# Altium project MT6205B.PrjPcb
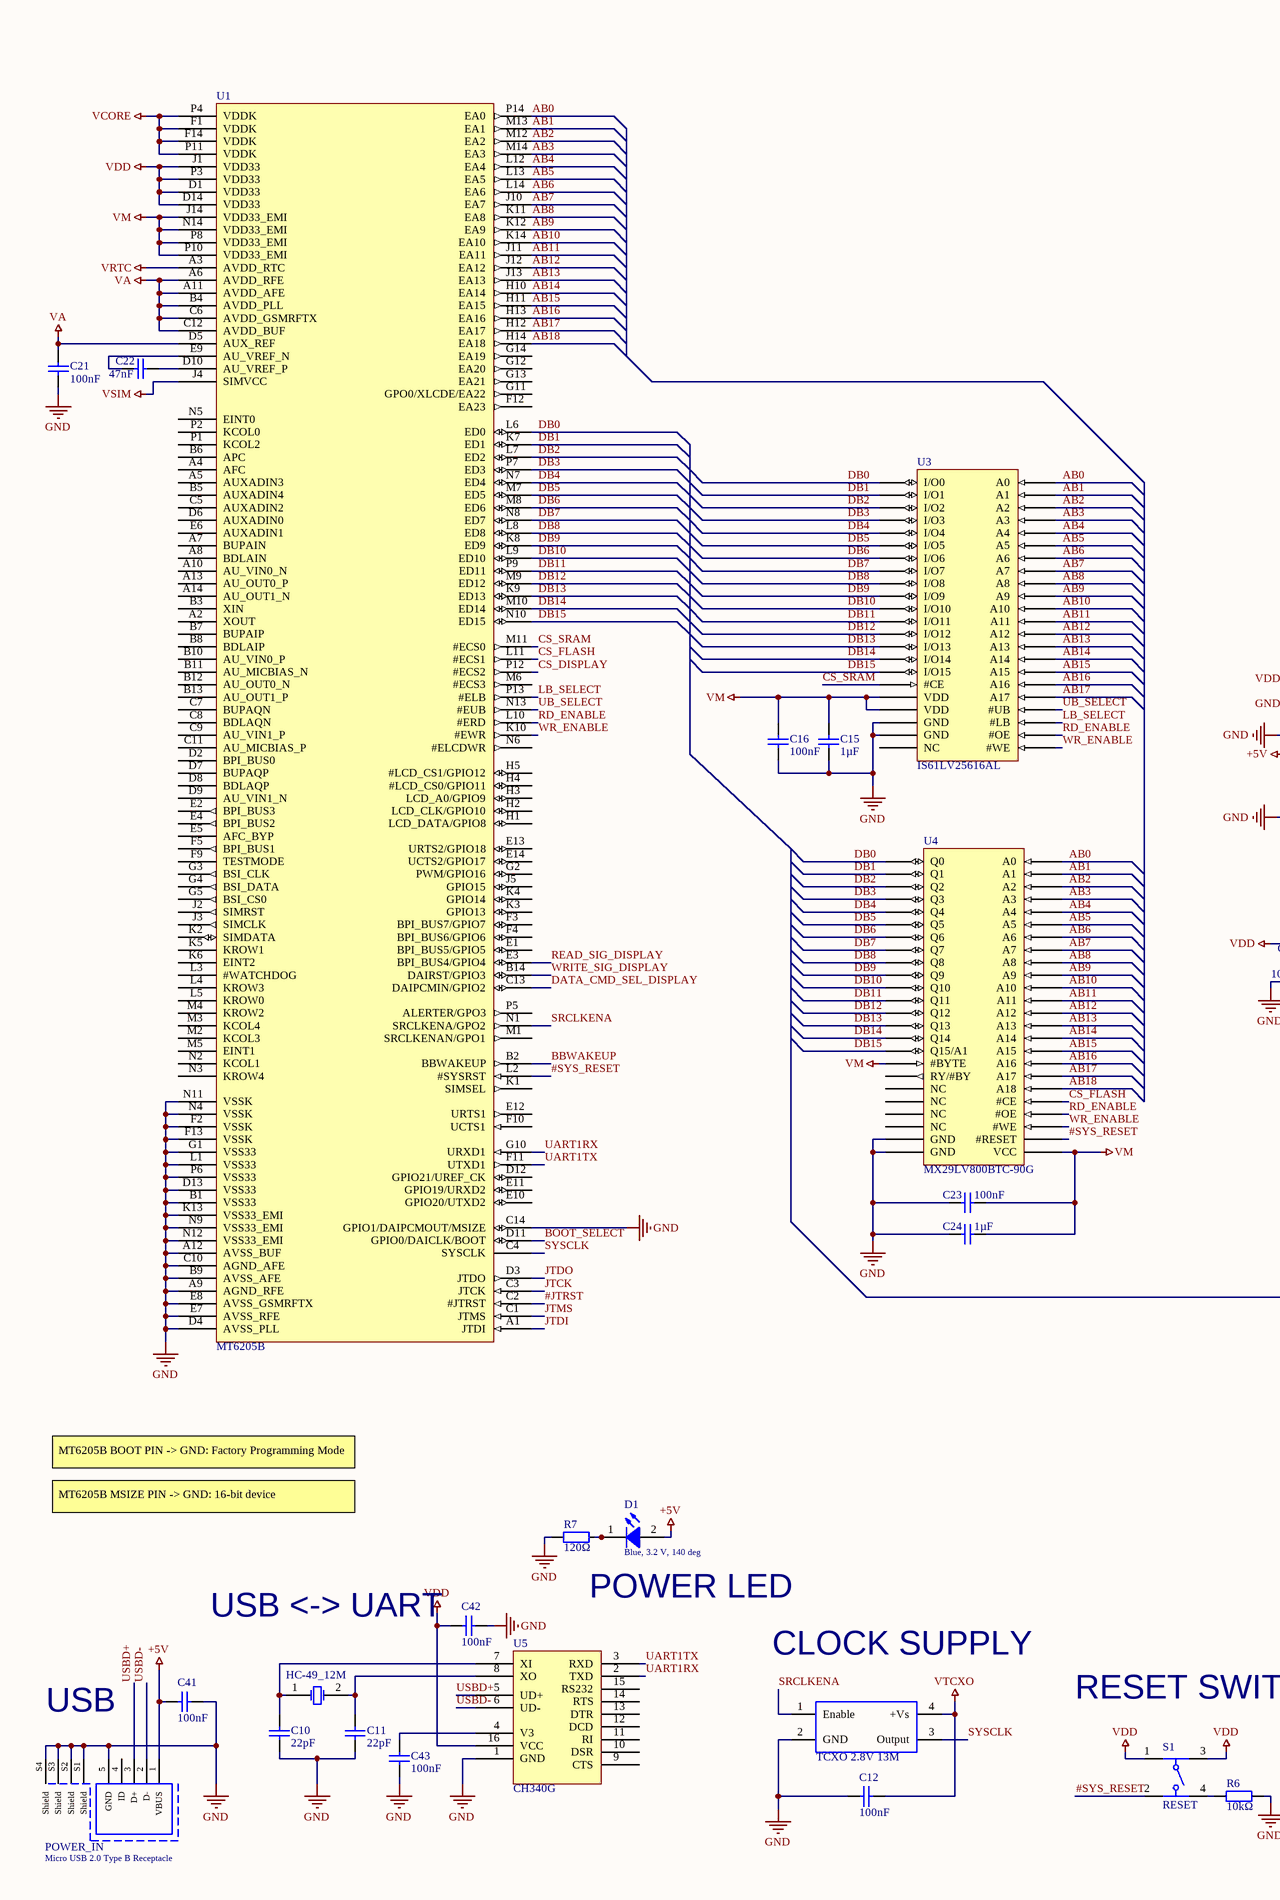
[diagram p0: MT6205B.SchDoc, left]
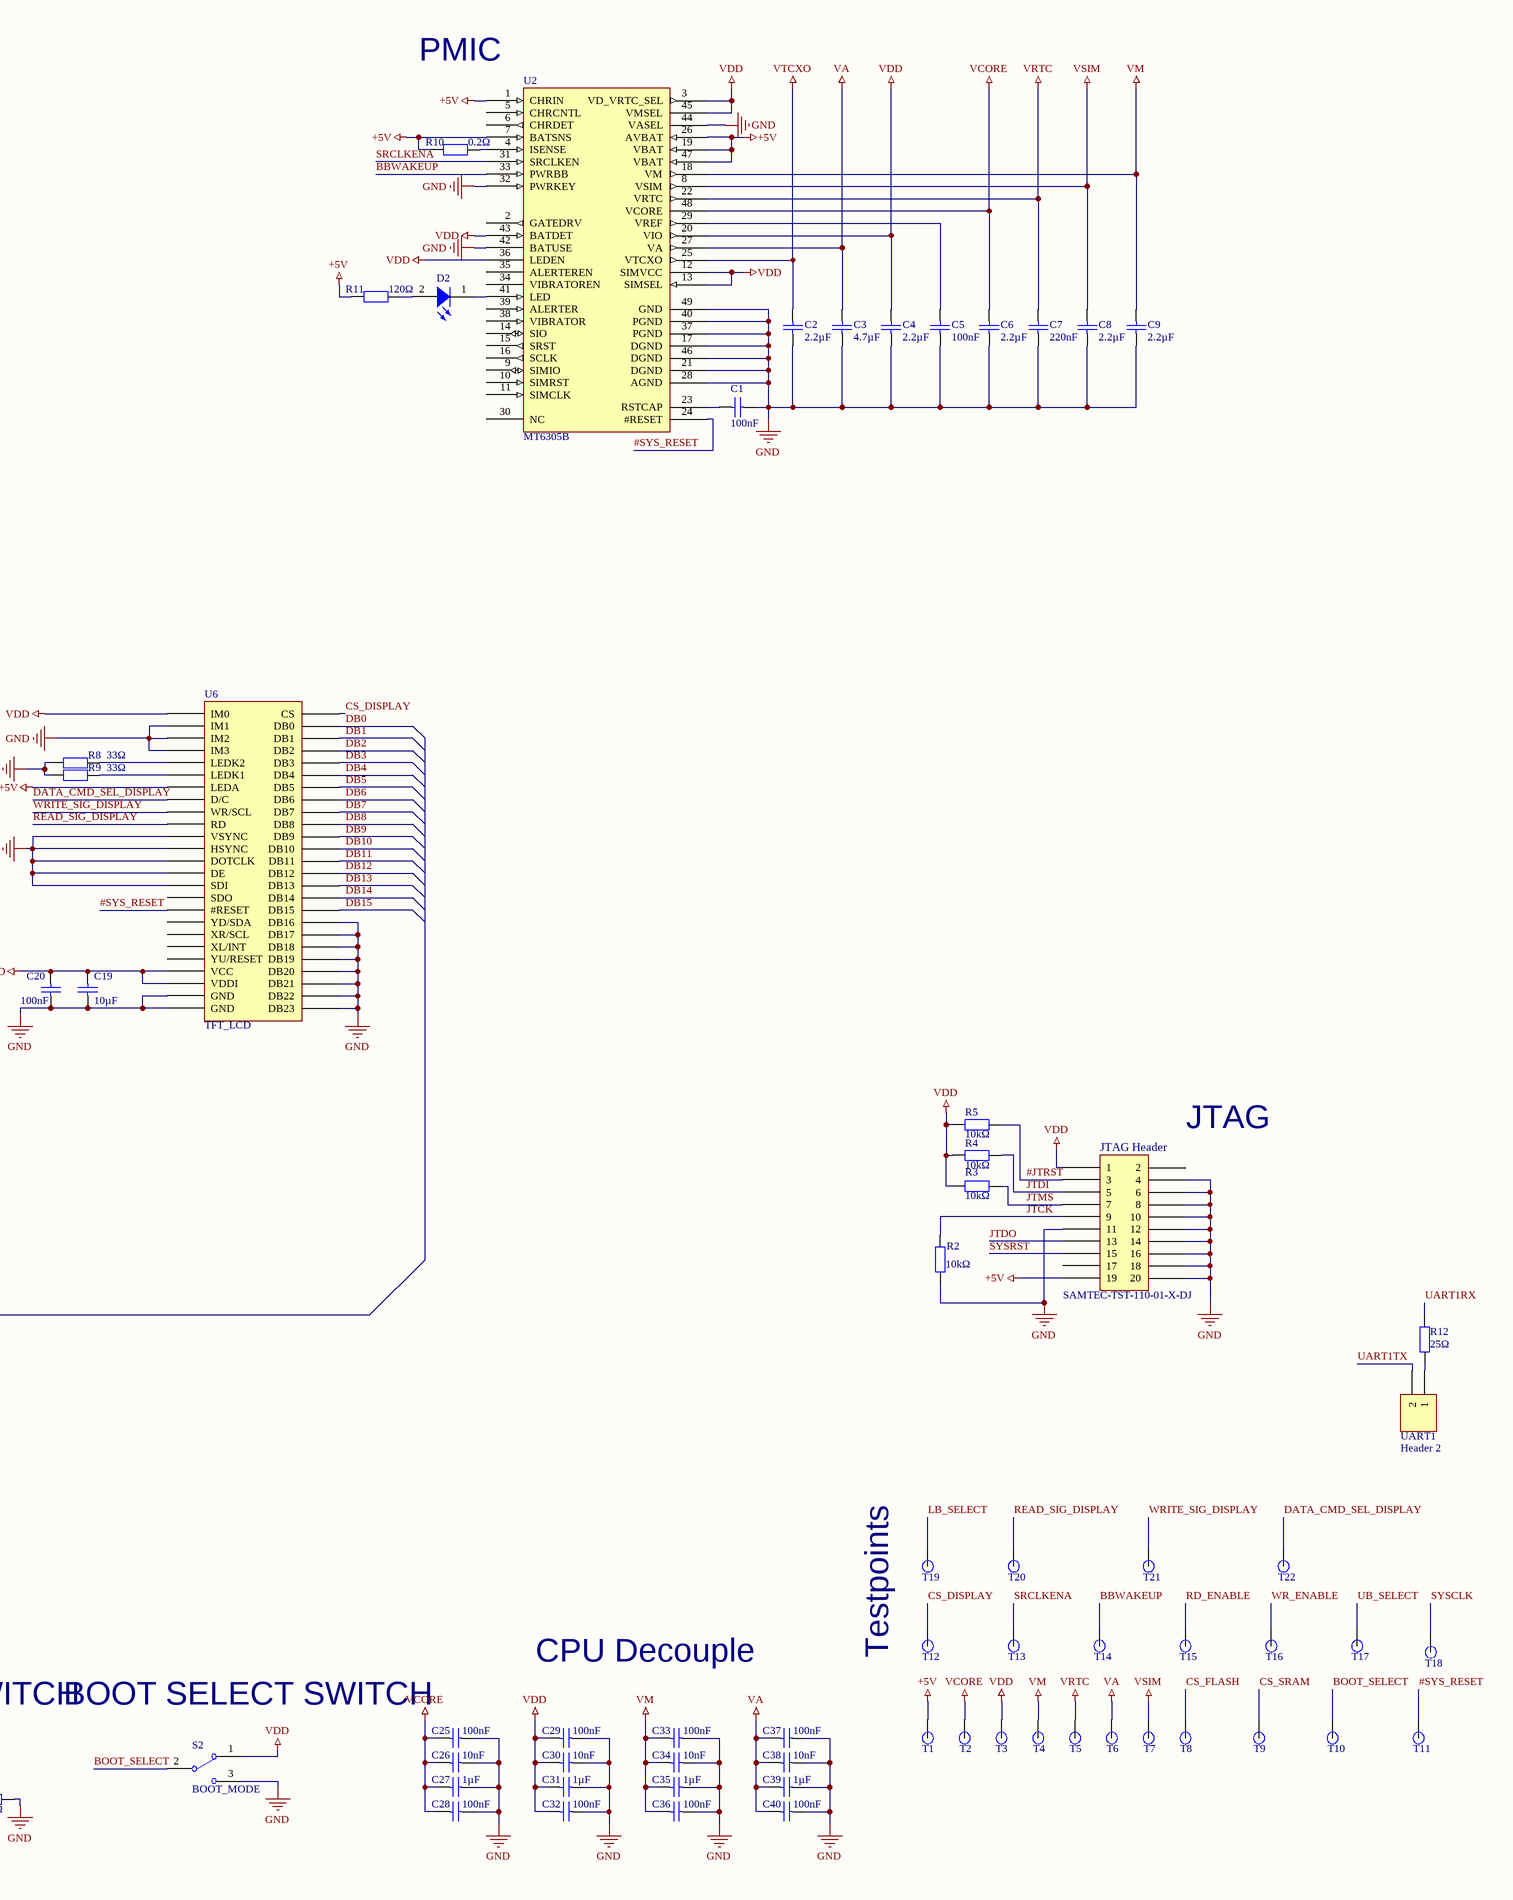
[diagram p1: MT6205B.SchDoc, right]
1 sheet, 87 parts. Net scope: global (net labels, ports and power ports of the same name join across sheets).
Board file: MT6205B.PcbDoc

## Sheet MT6205B.SchDoc
size A2; Organization: Altium Limited; Address1: L3, 12a Rodborough Rd; Address2: Frenchs Forest; Address3: NSW; Address4: Australia 2086

### Parts
C1  100nF  [WCAP-CSGP_0805_H=0.8mm_Reflow]
C2  2.2µF  [WCAP-CSGP_0805_H=0.8mm_Reflow]
C3  4.7µF  [WCAP-CSGP_0805_H=0.8mm_Reflow]
C4  2.2µF  [WCAP-CSGP_0805_H=0.8mm_Reflow]
C5  100nF  [WCAP-CSGP_0805_H=0.8mm_Reflow]
C6  2.2µF  [WCAP-CSGP_0805_H=0.8mm_Reflow]
C7  220nF  [WCAP-CSGP_0805_H=0.8mm_Reflow]
C8  2.2µF  [WCAP-CSGP_0805_H=0.8mm_Reflow]
C9  2.2µF  [WCAP-CSGP_0805_H=0.8mm_Reflow]
C10  22pF  [WCAP-CSGP_0805_H=0.8mm_Reflow]
C11  22pF  [WCAP-CSGP_0805_H=0.8mm_Reflow]
C12  100nF  [WCAP-CSGP_0805_H=0.8mm_Reflow]
C15  1µF  [WCAP-CSGP_0805_H=0.8mm_Reflow]
C16  100nF  [WCAP-CSGP_0805_H=0.8mm_Reflow]
C19  10µF  [WCAP-CSGP_0805_H=0.8mm_Reflow]
C20  100nF  [WCAP-CSGP_0805_H=0.8mm_Reflow]
C21  100nF  [WCAP-CSGP_0805_H=0.8mm_Reflow]
C22  47nF  [WCAP-CSGP_0805_H=0.8mm_Reflow]
C23  100nF  [WCAP-CSGP_0805_H=0.8mm_Reflow]
C24  1µF  [WCAP-CSGP_0805_H=0.8mm_Reflow]
C25  100nF  [WCAP-CSGP_0805_H=0.8mm_Reflow]
C26  10nF  [WCAP-CSGP_0805_H=0.8mm_Reflow]
C27  1µF  [WCAP-CSGP_0805_H=0.8mm_Reflow]
C28  100nF  [WCAP-CSGP_0805_H=0.8mm_Reflow]
C29  100nF  [WCAP-CSGP_0805_H=0.8mm_Reflow]
C30  10nF  [WCAP-CSGP_0805_H=0.8mm_Reflow]
C31  1µF  [WCAP-CSGP_0805_H=0.8mm_Reflow]
C32  100nF  [WCAP-CSGP_0805_H=0.8mm_Reflow]
C33  100nF  [WCAP-CSGP_0805_H=0.8mm_Reflow]
C34  10nF  [WCAP-CSGP_0805_H=0.8mm_Reflow]
C35  1µF  [WCAP-CSGP_0805_H=0.8mm_Reflow]
C36  100nF  [WCAP-CSGP_0805_H=0.8mm_Reflow]
C37  100nF  [WCAP-CSGP_0805_H=0.8mm_Reflow]
C38  10nF  [WCAP-CSGP_0805_H=0.8mm_Reflow]
C39  1µF  [WCAP-CSGP_0805_H=0.8mm_Reflow]
C40  100nF  [WCAP-CSGP_0805_H=0.8mm_Reflow]
C41  100nF  [WCAP-CSGP_0805_H=0.8mm_Reflow]
C42  100nF  [WCAP-CSGP_0805_H=0.8mm_Reflow]
C43  100nF  [WCAP-CSGP_0805_H=0.8mm_Reflow]
D1  Blue, 3.2 V, 140 deg  [WL-SMCW_0805]
D2  (no value)  [WL-SMCW_0805]
HC-49_12M  12MHz, +/-30ppm, 30pF  [WE-XTAL_HC49/4H]  (value not drawn)
JTAG_Header  SAMTEC-TST-110-01-X-DJ  [SAMTEC-TST-110-01-X-D]
POWER_IN  Micro USB 2.0 Type B Receptacle  [629105136821]
R2  10kΩ  [WRIS-PSMB_0805_H=0.22mm]
R3  10kΩ  [WRIS-PSMB_0805_H=0.22mm]
R4  10kΩ  [WRIS-PSMB_0805_H=0.22mm]
R5  10kΩ  [WRIS-PSMB_0805_H=0.22mm]
R6  10kΩ  [WRIS-PSMB_0805_H=0.22mm]
R7  120Ω  [WRIS-PSMB_0805_H=0.22mm]
R8  33Ω  [WRIS-PSMB_0805_H=0.22mm]
R9  33Ω  [WRIS-PSMB_0805_H=0.22mm]
R10  0.2Ω  [WRIS-PSMB_0805_H=0.22mm]
R11  120Ω  [WRIS-PSMB_0805_H=0.22mm]
R12  25Ω  [WRIS-PSMB_0805_H=0.22mm]
S1  RESET  [4301x60507x6]
S2  BOOT_MODE  [450404015514]
T1  (no value)  [Testpoint]
T2  (no value)  [Testpoint]
T3  (no value)  [Testpoint]
T4  (no value)  [Testpoint]
T5  (no value)  [Testpoint]
T6  (no value)  [Testpoint]
T7  (no value)  [Testpoint]
T8  (no value)  [Testpoint]
T9  (no value)  [Testpoint]
T10  (no value)  [Testpoint]
T11  (no value)  [Testpoint]
T12  (no value)  [Testpoint]
T13  (no value)  [Testpoint]
T14  (no value)  [Testpoint]
T15  (no value)  [Testpoint]
T16  (no value)  [Testpoint]
T17  (no value)  [Testpoint]
T18  (no value)  [Testpoint]
T19  (no value)  [Testpoint]
T20  (no value)  [Testpoint]
T21  (no value)  [Testpoint]
T22  (no value)  [Testpoint]
TCXO_2.8V_13M  12MHz, +/-50ppm, 3.3V  [WE-SPXO_CFPS-39]  (value not drawn)
U1  MT6205B  [MT6205B]
U2  MT6305B  [MT6305]
U3  IS61LV25616AL  [IS61LV25616AL]
U4  MX29LV800BTC-90G  [MX29LV800BTC-90G]
U5  CH340G  [CH340G]
U6  TFT_LCD  [687150149022]
UART1  Header 2  [HDR1X2]

### Nets
+5V: C41.1 D1.2(A) JTAG_Header.19 POWER_IN.1(VBUS) R10.1 R11.1 T1.1 U2.1(CHRIN) U2.7(BATSNS) U2.19(VBAT) U2.26(AVBAT) U2.47(VBAT) U6.1(LEDA)
GND: C1.2 C2.2 C3.2 C4.2 C5.2 C6.2 C7.2 C8.2 C9.2 C10.2 C11.2 C12.1 C15.1 C16.1 C19.1 C20.2 C21.1 C23.1 C24.1 C25.2 C26.2 C27.2 C28.2 C29.2 C30.2 C31.2 C32.2 C33.2 C34.2 C35.2 C36.2 C37.2 C38.2 C39.2 C40.2 C41.2 C42.2 C43.2 JTAG_Header.4 JTAG_Header.6 JTAG_Header.8 JTAG_Header.10 JTAG_Header.11 JTAG_Header.12 JTAG_Header.14 JTAG_Header.16 JTAG_Header.18 JTAG_Header.20 POWER_IN.5(GND) POWER_IN.S1(Shield) POWER_IN.S2(Shield) POWER_IN.S3(Shield) POWER_IN.S4(Shield) R2.1 R6.1 R7.1 R8.2 R9.2 S2.3 TCXO_2.8V_13M.2(GND) U1.A9(AGND_RFE) U1.A12(AVSS_BUF) U1.B1(VSS33) U1.B9(AVSS_AFE) U1.C10(AGND_AFE) U1.C14(GPIO1/DAIPCMOUT/MSIZE) U1.D4(AVSS_PLL) U1.D13(VSS33) U1.E7(AVSS_RFE) U1.E8(AVSS_GSMRFTX) U1.F2(VSSK) U1.F13(VSSK) U1.G1(VSS33) U1.K13(VSS33_EMI) U1.L1(VSS33) U1.N4(VSSK) U1.N9(VSS33_EMI) U1.N11(VSSK) U1.N12(VSS33_EMI) U1.P6(VSS33) U2.17(DGND) U2.21(DGND) U2.28(AGND) U2.32(PWRKEY) U2.37(PGND) U2.40(PGND) U2.42(BATUSE) U2.44(VASEL) U2.46(DGND) U2.49(GND) U3.12(GND) U3.34(GND) U4.27(GND) U4.46(GND) U5.1(GND) U6.5(IM1) U6.6(IM2) U6.7(IM3) U6.9(VSYNC) U6.10(HSYNC) U6.11(DOTCLK) U6.12(DE) U6.29(DB16) U6.30(DB17) U6.31(DB18) U6.32(DB19) U6.33(DB20) U6.34(DB21) U6.35(DB22) U6.36(DB23) U6.38(SDI) U6.45(GND) U6.50(GND)
VA: C3.1 C21.2 C37.1 C38.1 C39.1 C40.1 T6.1 U1.A6(AVDD_RFE) U1.A11(AVDD_AFE) U1.B4(AVDD_PLL) U1.C6(AVDD_GSMRFTX) U1.C12(AVDD_BUF) U1.D5(AUX_REF) U2.27(VA)
VCORE: C6.1 C25.1 C26.1 C27.1 C28.1 T2.1 U1.F1(VDDK) U1.F14(VDDK) U1.P4(VDDK) U1.P11(VDDK) U2.48(VCORE)
VDD: C4.1 C19.2 C20.1 C29.1 C30.1 C31.1 C32.1 C42.1 JTAG_Header.1 R3.2 R4.2 R5.2 S1.1 S1.3 S2.1 T3.1 U1.D1(VDD33) U1.D14(VDD33) U1.J1(VDD33) U1.P3(VDD33) U2.3(VD_VRTC_SEL) U2.12(SIMVCC) U2.13(SIMSEL) U2.20(VIO) U2.36(LEDEN) U2.43(BATDET) U2.45(VMSEL) U5.16(VCC) U6.4(IM0) U6.43(VDDI) U6.44(VCC)
VM: C9.1 C15.2 C16.2 C23.2 C24.2 C33.1 C34.1 C35.1 C36.1 T4.1 U1.J14(VDD33_EMI) U1.N14(VDD33_EMI) U1.P8(VDD33_EMI) U1.P10(VDD33_EMI) U2.18(VM) U3.11(VDD) U3.33(VDD) U4.37(VCC) U4.47(#BYTE)
VRTC: C7.1 T5.1 U1.A3(AVDD_RTC) U2.22(VRTC)
VSIM: C8.1 T7.1 U1.J4(SIMVCC) U2.8(VSIM)
VTCXO: C2.1 C12.2 TCXO_2.8V_13M.4(+Vs) U2.25(VTCXO)
#JTRST: JTAG_Header.3 R5.1 U1.C2(#JTRST)
#SYS_RESET: S1.2 T11.1 U1.L2(#SYSRST) U2.24(#RESET) U4.12(#RESET) U6.8(#RESET)
AB0: U1.P14(EA0) U3.1(A0) U4.25(A0)
AB1: U1.M13(EA1) U3.2(A1) U4.24(A1)
AB2: U1.M12(EA2) U3.3(A2) U4.23(A2)
AB3: U1.M14(EA3) U3.4(A3) U4.22(A3)
AB4: U1.L12(EA4) U3.5(A4) U4.21(A4)
AB5: U1.L13(EA5) U3.18(A5) U4.20(A5)
AB6: U1.L14(EA6) U3.19(A6) U4.19(A6)
AB7: U1.J10(EA7) U3.20(A7) U4.18(A7)
AB8: U1.K11(EA8) U3.21(A8) U4.8(A8)
AB9: U1.K12(EA9) U3.22(A9) U4.7(A9)
AB10: U1.K14(EA10) U3.23(A10) U4.6(A10)
AB11: U1.J11(EA11) U3.24(A11) U4.5(A11)
AB12: U1.J12(EA12) U3.25(A12) U4.4(A12)
AB13: U1.J13(EA13) U3.26(A13) U4.3(A13)
AB14: U1.H10(EA14) U3.27(A14) U4.2(A14)
AB15: U1.H11(EA15) U3.42(A15) U4.1(A15)
AB16: U1.H13(EA16) U3.43(A16) U4.48(A16)
AB17: U1.H12(EA17) U3.44(A17) U4.17(A17)
AB18: U1.H14(EA18) U4.16(A18)
BBWAKEUP: T14.1 U1.B2(BBWAKEUP) U2.33(PWRBB)
BOOT_SELECT: S2.2(COM) T10.1 U1.D11(GPIO0/DAICLK/BOOT)
CS_DISPLAY: T12.1 U1.P12(#ECS2) U6.42(CS)
CS_FLASH: T8.1 U1.L11(#ECS1) U4.26(#CE)
CS_SRAM: T9.1 U1.M11(#ECS0) U3.6(#CE)
DATA_CMD_SEL_DISPLAY: T22.1 U1.C13(DAIPCMIN/GPIO2) U6.41(D/C)
DB0: U1.L6(ED0) U3.7(I/O0) U4.29(Q0) U6.13(DB0)
DB1: U1.K7(ED1) U3.8(I/O1) U4.31(Q1) U6.14(DB1)
DB2: U1.L7(ED2) U3.9(I/O2) U4.33(Q2) U6.15(DB2)
DB3: U1.P7(ED3) U3.10(I/O3) U4.35(Q3) U6.16(DB3)
DB4: U1.N7(ED4) U3.13(I/O4) U4.38(Q4) U6.17(DB4)
DB5: U1.M7(ED5) U3.14(I/O5) U4.40(Q5) U6.18(DB5)
DB6: U1.M8(ED6) U3.15(I/O6) U4.42(Q6) U6.19(DB6)
DB7: U1.N8(ED7) U3.16(I/O7) U4.44(Q7) U6.20(DB7)
DB8: U1.L8(ED8) U3.29(I/O8) U4.30(Q8) U6.21(DB8)
DB9: U1.K8(ED9) U3.30(I/O9) U4.32(Q9) U6.22(DB9)
DB10: U1.L9(ED10) U3.31(I/O10) U4.34(Q10) U6.23(DB10)
DB11: U1.P9(ED11) U3.32(I/O11) U4.36(Q11) U6.24(DB11)
DB12: U1.M9(ED12) U3.35(I/O12) U4.39(Q12) U6.25(DB12)
DB13: U1.K9(ED13) U3.36(I/O13) U4.41(Q13) U6.26(DB13)
DB14: U1.M10(ED14) U3.37(I/O14) U4.43(Q14) U6.27(DB14)
DB15: U1.N10(ED15) U3.38(I/O15) U4.45(Q15/A1) U6.28(DB15)
JTCK: JTAG_Header.9 R2.2 U1.C3(JTCK)
JTDI: JTAG_Header.5 R4.1 U1.A1(JTDI)
JTDO: JTAG_Header.13 U1.D3(JTDO)
JTMS: JTAG_Header.7 R3.1 U1.C1(JTMS)
LB_SELECT: T19.1 U1.P13(#ELB) U3.39(#LB)
RD_ENABLE: T15.1 U1.L10(#ERD) U3.41(#OE) U4.28(#OE)
READ_SIG_DISPLAY: T20.1 U1.E3(BPI_BUS4/GPIO4) U6.39(RD)
SRCLKENA: T13.1 TCXO_2.8V_13M.1(Enable) U1.N1(SRCLKENA/GPO2) U2.31(SRCLKEN)
SYSCLK: T18.1 TCXO_2.8V_13M.3(Output) U1.C4(SYSCLK)
SYSRST: JTAG_Header.15
UART1RX: R12.2 U1.G10(URXD1) U5.2(TXD)
UART1TX: U1.F11(UTXD1) U5.3(RXD) UART1.2
UB_SELECT: T17.1 U1.N13(#EUB) U3.40(#UB)
USBD+: POWER_IN.3(D+) U5.5(UD+)
USBD-: POWER_IN.2(D-) U5.6(UD-)
WR_ENABLE: T16.1 U1.K10(#EWR) U3.17(#WE) U4.11(#WE)
WRITE_SIG_DISPLAY: T21.1 U1.B14(DAIRST/GPIO3) U6.40(WR/SCL)
NetC1_1: C1.1 U2.23(RSTCAP)
NetC5_1: C5.1 U2.29(VREF)
NetC10_1: C10.1 HC-49_12M.1(OSC1) U5.7(XI)
NetC11_1: C11.1 HC-49_12M.2(OSC2) U5.8(XO)
NetC22_1: C22.1 U1.E9(AU_VREF_N)
NetC22_2: C22.2 U1.D10(AU_VREF_P)
NetC43_1: C43.1 U5.4(V3)
NetD1_1: D1.1(K) R7.2
NetD2_1: D2.1(K) U2.41(LED)
NetD2_2: D2.2(A) R11.2
NetR6_2: R6.2 S1.4
NetR8_1: R8.1 U6.3(LEDK2)
NetR9_1: R9.1 U6.2(LEDK1)
NetR10_2: R10.2 U2.4(ISENSE)
NetR12_1: R12.1 UART1.1

Not connected (* = marked no-connect by the designer): JTAG_Header 2 17; POWER_IN 4(ID); U1 A2(XOUT) A4(AFC) A5(AUXADIN3) A7(BUPAIN) A8(BDLAIN) A10(AU_VIN0_N) A13(AU_OUT0_P) A14(AU_OUT1_N) B3(XIN) B5(AUXADIN4) B6(APC) B7(BUPAIP) B8(BDLAIP) B10(AU_VIN0_P) B11(AU_MICBIAS_N) B12(AU_OUT0_N) B13(AU_OUT1_P) C5(AUXADIN2) C7(BUPAQN) C8(BDLAQN) C9(AU_VIN1_P) C11(AU_MICBIAS_P) D2(BPI_BUS0) D6(AUXADIN0) D7(BUPAQP) D8(BDLAQP) D9(AU_VIN1_N) D12(GPIO21/UREF_CK) E1(BPI_BUS5/GPIO5) E2(BPI_BUS3) E4(BPI_BUS2) E5(AFC_BYP) E6(AUXADIN1) E10(GPIO20/UTXD2) E11(GPIO19/URXD2) E12(URTS1) E13(URTS2/GPIO18) E14(UCTS2/GPIO17) F3(BPI_BUS7/GPIO7) F4(BPI_BUS6/GPIO6) F5(BPI_BUS1) F9(TESTMODE) F10(UCTS1) F12(EA23) G2(PWM/GPIO16) G3(BSI_CLK) G4(BSI_DATA) G5(BSI_CS0) G11(GPO0/XLCDE/EA22) G12(EA20) G13(EA21) G14(EA19) H1(LCD_DATA/GPIO8) H2(LCD_CLK/GPIO10) H3(LCD_A0/GPIO9) H4(#LCD_CS0/GPIO11) H5(#LCD_CS1/GPIO12) J2(SIMRST) J3(SIMCLK) J5(GPIO15) K1(SIMSEL) K2(SIMDATA) K3(GPIO13) K4(GPIO14) K5(KROW1) K6(EINT2) L3(#WATCHDOG) L4(KROW3) L5(KROW0) M1(SRCLKENAN/GPO1) M2(KCOL3) M3(KCOL4) M4(KROW2) M5(EINT1) M6(#ECS3) N2(KCOL1) N3(KROW4) N5(EINT0) N6(#ELCDWR) P1(KCOL2) P2(KCOL0) P5(ALERTER/GPO3); U2 2(GATEDRV) 5(CHRCNTL) 6(CHRDET) 9(SIMIO) 10(SIMRST) 11(SIMCLK) 14(SIO) 15(SRST) 16(SCLK) 30(NC) 34(VIBRATOREN) 35(ALERTEREN) 38(VIBRATOR) 39(ALERTER); U3 28(NC); U4 9(NC) 10(NC) 13(NC) 14(NC) 15(RY/#BY); U5 9(CTS) 10(DSR) 11(RI) 12(DCD) 13(DTR) 14(RTS) 15(RS232); U6 37(SDO) 46(XR/SCL) 47(YD/SDA) 48(XL/INT) 49(YU/RESET)

### Notes on the sheet
- (near U2) PMIC
- (near JTAG_Header) JTAG
- MT6205B BOOT PIN -> GND: Factory Programming Mode
- MT6205B MSIZE PIN -> GND: 16-bit device
- POWER LED
- USB <-> UART
- CLOCK SUPPLY
- CPU Decouple
- Testpoints
- USB
- RESET SWITCH
- (near S2) BOOT SELECT SWITCH
- Title
- Size:
- Date:
- File:
- A2
- Number:
- Time:
- Revision:
- Sheet
- of

### Library data of the parts
C1-C12 C15 C16 C19-C43 = Cap: Capacitor; Published: 8-Jun-2000; LatestRevisionDate: 17-Jul-2002; LatestRevisionNote: Re-released for DXP Platform.; PackageReference: RAD-0.3; Publisher: Altium Limited; PackageDescription: Radial Cap, Thru-Hole; 2 Leads; 0.3 in Pin Spacing
D1 D2 = 150080BS75000: SMT Mono-color Chip LED Waterclear WL-SMCW, size 0805, Blue, 3.2 V, 140 deg, 145 mcd; Forward Voltage: 3.2 V; Viewing Angle: 140 deg; Peak Wavelength: 465 nm; Dominant Wavelength: 470 nm; Luminous Intensity: 145 mcd; Chip Technology: InGaN; ComponentLink1Description: Manufacturer; ComponentLink1URL: http://www.we-online.de; ComponentLink2Description: Datasheet; ComponentLink2URL: https://katalog.we-online.de/led/datasheet/150080BS75000.pdf; Part Number: 150080BS75000; Published Date: November 2018; Publisher: Wurth Elektronik; Size: 0805; Operating Temperature: -40 to 85 degC; Emitting Color: Blue; Mounting Technology: SMT; Packaging: Tape and Reel
HC-49_12M = 830003215B: WE-XTAL Quartz Crystal, size HC49-4H, 12MHz, +/-30ppm, 30pF; Frequency Stability: 50ppm; ComponentLink1Description: Manufacturer; ComponentLink1URL: http://www.we-online.de; ComponentLink2Description: Datasheet; ComponentLink2URL: https://katalog.we-online.com/pbs/datasheet/830003215B.pdf; Part Number: 830003215B; Published Date: March 2019; Publisher: Wurth Elektronik; Size: HC49-4H; Operating Temperature: -20 up to +70degC; Mounting Technology: THT; Packaging: Bulk; Load Capacitance: 30pF; Frequency Tolerance: +/-30ppm; Frequency: 12MHz
JTAG_Header = SAMTEC-TST-110-01-X-DJ: GateName_1: A; SymbolName_1: SAMTEC-TST-110-01-X-DA; DeviceName: J; LibraryName: SAMTEC-TST-110-01-X-D; DeviceSetName: SAMTEC-TST-110-01-X-D; Package: SAMTEC-TST-110-01-X-D
POWER_IN = 629105136821: Micro USB 2.0 Type B, Receptacle, Horizontal, SMT; Rated Current: 1A; Pin Number: 5; Interface Type: Type B; Working Voltage: 30VAC; ComponentLink1Description: Manufacturer; ComponentLink1URL: http://www.we-online.de; ComponentLink2Description: Datasheet; ComponentLink2URL: https://katalog.we-online.com/em/datasheet/629105136821.pdf; Published Date: September 2019; Publisher: Wurth Elektronik; Part Number: 629105136821; Gender: Receptacle; Type: Horizontal; Packaging: Tape and Reel; Operating Temperature: -40 to +105degC; Mounting Technology: SMT; Application: Micro USB 2.0
R2-R12 = Res2: Resistor; Published: 8-Jun-2000; LatestRevisionDate: 17-Jul-2002; LatestRevisionNote: Re-released for DXP Platform.; PackageReference: AXIAL-0.4; Publisher: Altium Limited; PackageDescription: Axial Device, Thru-Hole; 2 Leads; 0.4 in Pin Spacing
S1 = 430156050726: WS-TATV THT Tact Switch 6x6mm, height 5mm, 260gf; Rated Voltage: 12VDC; Rated Current: 50mA; Washable: No; ComponentLink1Description: Manufacturer; ComponentLink1URL: http://www.we-online.de; ComponentLink2Description: Datasheet; ComponentLink2URL: https://katalog.we-online.com/em/datasheet/430156050726.pdf; Operating Temperature: -40 to +85degC; Part Number: 430156050726; Published Date: September 2019; Contact Material: Stainless Steel; Height: 5mm; Mounting Technology: THT; Contact Plating: Silver; Operation Force: 260gf; Packaging: Bulk; Terminal Material: Copper Alloy; Publisher: Wurth Elektronik; Terminal Plating: Silver
S2 = 450404015514: WS-SLSU Mini SMT Slide Switch, Same Side Connection, Right Angled, SPDT; Rated Current: 300mA; Rated Voltage: 5VDC; Switching Function: On-On; ComponentLink1Description: Manufacturer; ComponentLink1URL: http://www.we-online.de; ComponentLink2Description: Datasheet; ComponentLink2URL: https://katalog.we-online.com/em/datasheet/450404015514.pdf; Packaging: Tape and Reel; Publisher: Wurth Elektronik; Contact Material: Copper Alloy; Mounting Technology: SMT; Operating Temperature: -40 to +85degC; Contact Plating: Silver; Part Number: 450404015514; Published Date: September 2019; Terminal Material: Copper Alloy; Size: 6.7x2.7mm; Circuit: SPDT; Terminal Plating: Silver
T1-T22 = Testpoint
TCXO_2.8V_13M = 831025492: WE-SPXO Simple Packaged Quartz Oscillator, size CFPS-39, 12MHz, +/-50ppm, 3.3V; Frequency Stability: 50ppm; ComponentLink1Description: Manufacturer; ComponentLink1URL: http://www.we-online.de; ComponentLink2Description: Datasheet; ComponentLink2URL: https://katalog.we-online.com/pbs/datasheet/831025492.pdf; Part Number: 831025492; Published Date: March 2019; Publisher: Wurth Elektronik; Size: CFPS-39; Operating Temperature: -40 up to +85degC; Mounting Technology: SMT; Packaging: Tape and Reel; Supply Voltage: 3.3V; Frequency: 12MHz
U6 = ER_TFT040_1
UART1 = Header 2: Header, 2-Pin; LatestRevisionDate: 17-Jul-2002; LatestRevisionNote: Re-released for DXP Platform.; Publisher: Altium Limited